# Altium project uz_per_wolfspeed_25kw_FM3.PrjPcb (part 1 of 2)
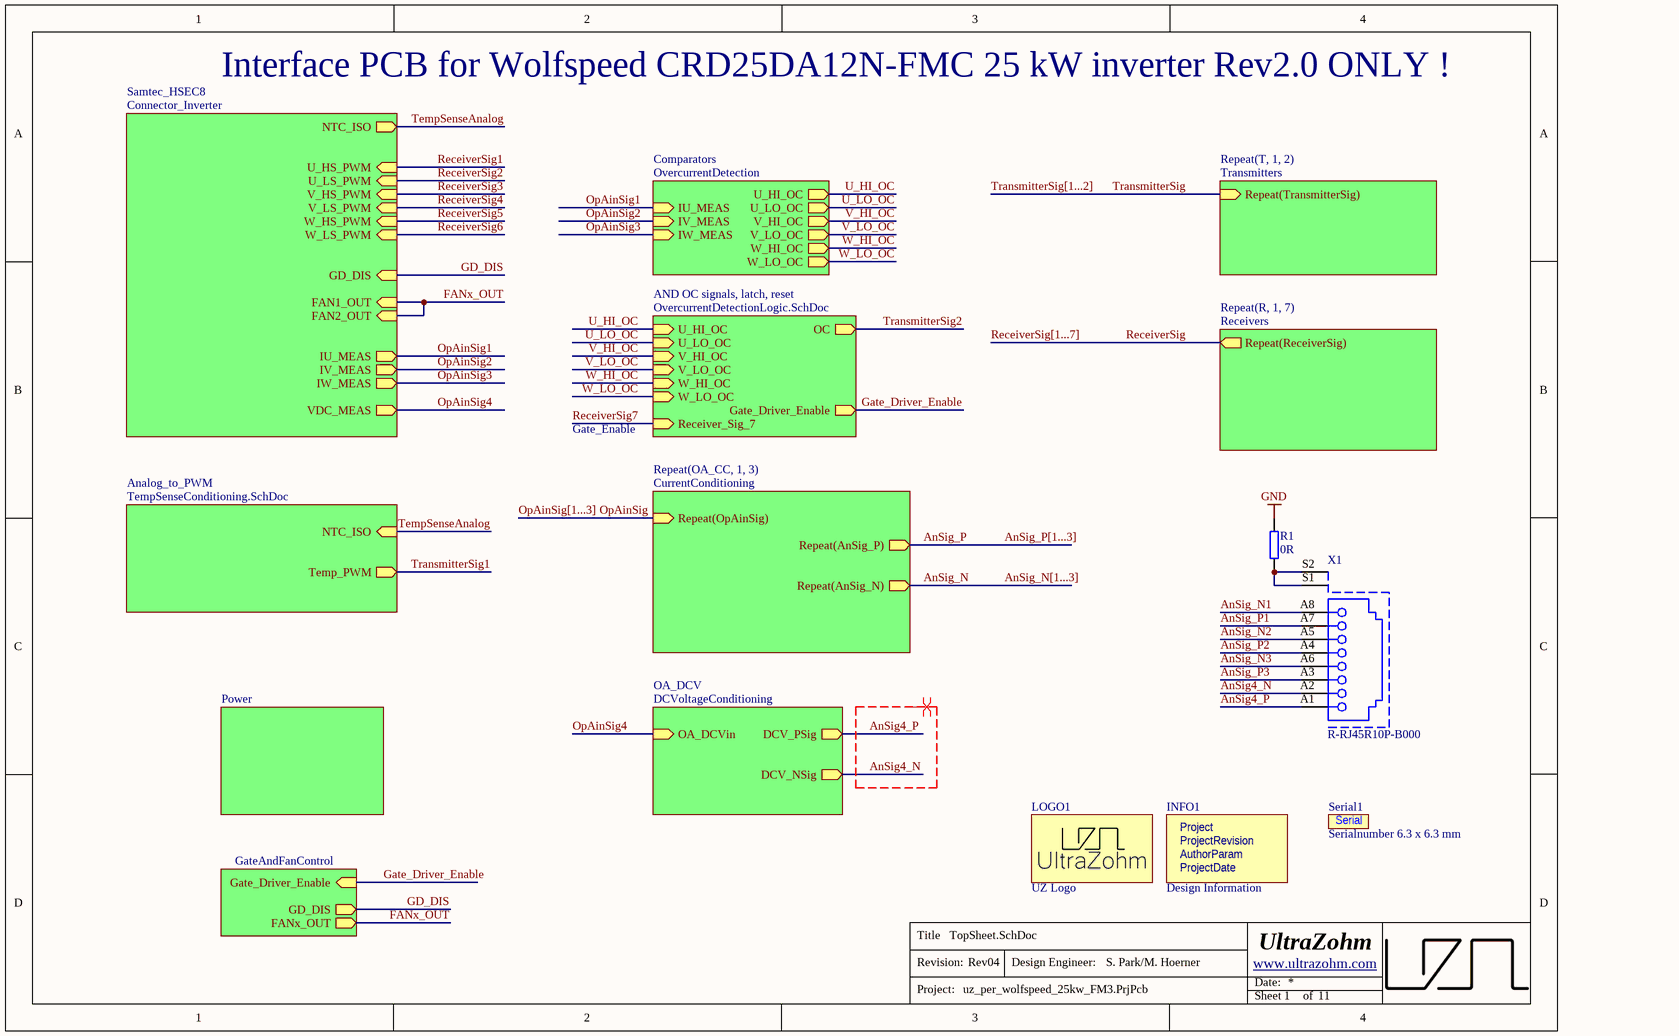
[diagram p0: TopSheet.SchDoc]
AuthorParam: S. Park/M. Hoerner; Project: uz_per_wolfspeed_25kw_FM3; ProjectDate: 06/26; ProjectRevision: Rev04
11 sheets, 229 parts. Net scope: hierarchical (ports join the sheet entries above them; power ports are global).
Board file: uz_per_wolfspeed_25kw_FM3.PcbDoc
Sheets:
  TopSheet.SchDoc
    Samtec_HSEC8 = Connector_Inverter.SchDoc
    OA_CC1 = CurrentConditioning.SchDoc
    OA_CC2 = CurrentConditioning.SchDoc
    OA_CC3 = CurrentConditioning.SchDoc
    T1 = Transmitters.SchDoc
    T2 = Transmitters.SchDoc
    Comparators = OvercurrentDetection.SchDoc
    R1 = Receivers.SchDoc
    R2 = Receivers.SchDoc
    R3 = Receivers.SchDoc
    R4 = Receivers.SchDoc
    R5 = Receivers.SchDoc
    R6 = Receivers.SchDoc
    R7 = Receivers.SchDoc
    Designator = Power.SchDoc
    OA_DCV = DCVoltageConditioning.SchDoc
    Gate_and_Fan_Control = GateAndFanControl.SchDoc
    AND OC signals, latch, reset = OvercurrentDetectionLogic.SchDoc
    Analog_to_PWM = TempSenseConditioning.SchDoc

## Sheet TopSheet.SchDoc
size A4; Organization: UltraZohm; DocumentNumber: 1; SheetNumber: 1; SheetTotal: 11; Website: www.ultrazohm.com

### Parts
INFO1  Design Information  [Design_info]  (no BOM)
LOGO1  UZ Logo  [UZ_Logo_small]  (no BOM)
R1  0R  [RES 0603_1608]
Serial1  Serialnumber 6.3 x 6.3 mm  [SERIAL_6.3X6.3MM]  (no BOM)
X1  R-RJ45R10P-B000  [R-RJ45R10P-B000]

### Sub-sheets
Analog_to_PWM = TempSenseConditioning.SchDoc: NTC_ISO (in), Temp_PWM (out)
AND OC signals, latch, reset = OvercurrentDetectionLogic.SchDoc: U_HI_OC (in), U_LO_OC (in), V_HI_OC (in), V_LO_OC (in), W_HI_OC (in), OC (out), W_LO_OC (in), Receiver_Sig_7 (in), Gate_Driver_Enable (out)
Comparators = OvercurrentDetection: IU_MEAS (in), IV_MEAS (in), IW_MEAS (in), U_HI_OC (out), U_LO_OC (out), V_HI_OC (out), V_LO_OC (out), W_HI_OC (out), W_LO_OC (out)
Designator = Power: no entries
Gate_and_Fan_Control = GateAndFanControl: FANx_OUT (out), GD_DIS (out), Gate_Driver_Enable (in)
OA_DCV = DCVoltageConditioning: OA_DCVin (in), DCV_PSig (out), DCV_NSig (out)
Repeat(OA_CC, 1, 3) = CurrentConditioning: Repeat(OpAinSig) (in), Repeat(AnSig_P) (out), Repeat(AnSig_N) (out)
Repeat(R, 1, 7) = Receivers: Repeat(ReceiverSig) (out)
Repeat(T, 1, 2) = Transmitters: Repeat(TransmitterSig) (in)
Samtec_HSEC8 = Connector_Inverter: NTC_ISO (out), U_HS_PWM (in), U_LS_PWM (in), V_HS_PWM (in), V_LS_PWM (in), W_HS_PWM (in), W_LS_PWM (in), GD_DIS (in), FAN1_OUT (in), FAN2_OUT (in), IU_MEAS (out), IV_MEAS (out), IW_MEAS (out), VDC_MEAS (out)

### Nets
GND: R1.1
AnSig4_N: X1.A2 ; sheet OA_DCV/DCV_NSig
AnSig4_P: X1.A1 ; sheet OA_DCV/DCV_PSig
AnSig_N: sheet Repeat(OA_CC, 1, 3)/Repeat(AnSig_N)
AnSig_N1: X1.A8  [project net AnSig_N]
AnSig_N2: X1.A5  [project net AnSig_N]
AnSig_N3: X1.A6  [project net AnSig_N]
AnSig_P: sheet Repeat(OA_CC, 1, 3)/Repeat(AnSig_P)
AnSig_P1: X1.A7  [project net AnSig_P]
AnSig_P2: X1.A4  [project net AnSig_P]
AnSig_P3: X1.A3  [project net AnSig_P]
FANx_OUT: sheet Samtec_HSEC8/FAN1_OUT, sheet Samtec_HSEC8/FAN2_OUT, sheet Gate_and_Fan_Control/FANx_OUT, sheet Gate_and_Fan_Control/Gate_Driver_Enable, sheet AND OC signals, latch, reset/Gate_Driver_Enable  [also labelled Gate_Driver_Enable]
GD_DIS: sheet Samtec_HSEC8/GD_DIS, sheet Gate_and_Fan_Control/GD_DIS
OpAinSig: sheet Repeat(OA_CC, 1, 3)/Repeat(OpAinSig)
OpAinSig1: sheet Samtec_HSEC8/IU_MEAS, sheet Comparators/IU_MEAS
OpAinSig2: sheet Samtec_HSEC8/IV_MEAS, sheet Comparators/IV_MEAS
OpAinSig3: sheet Samtec_HSEC8/IW_MEAS, sheet Comparators/IW_MEAS
OpAinSig4: sheet Samtec_HSEC8/VDC_MEAS, sheet OA_DCV/OA_DCVin
ReceiverSig: sheet Repeat(R, 1, 7)/Repeat(ReceiverSig)
TempSenseAnalog: sheet Samtec_HSEC8/NTC_ISO, sheet Analog_to_PWM/NTC_ISO
TransmitterSig: sheet Repeat(T, 1, 2)/Repeat(TransmitterSig)
U_HI_OC: sheet Comparators/U_HI_OC, sheet AND OC signals, latch, reset/U_HI_OC
U_LO_OC: sheet Comparators/U_LO_OC, sheet AND OC signals, latch, reset/U_LO_OC
V_HI_OC: sheet Comparators/V_HI_OC, sheet AND OC signals, latch, reset/V_HI_OC
V_LO_OC: sheet Comparators/V_LO_OC, sheet AND OC signals, latch, reset/V_LO_OC
W_HI_OC: sheet Comparators/W_HI_OC, sheet AND OC signals, latch, reset/W_HI_OC
W_LO_OC: sheet Comparators/W_LO_OC, sheet AND OC signals, latch, reset/W_LO_OC
NetR1_2: R1.2 X1.S1 X1.S2

### Buses and harness runs
bus AnSig_N[1...3]
bus AnSig_P[1...3]
bus OpAinSig[1...3]
bus ReceiverSig[1...7]
bus TransmitterSig[1...2]

### Layout directives
differential pair: AnSig4_N, AnSig4_P

### Notes on the sheet
- Interface PCB for Wolfspeed CRD25DA12N-FMC 25 kW inverter Rev2.0 ONLY !
- Gate_Enable
- Title
- Revision:
- Design Engineer:
- Date:
- Project:
- Sheet
- of
- (in symbol Design Information) Project; ProjectRevision; AuthorParam; ProjectDate
- (in symbol Serial Number) Serial

### Library data of the parts
INFO1 = Design Information: Manufacturer: UltraZohm; Created from: MGremer; Manufacturer Part Number: Design Information; PartID: 12; Created On: 03/11/2021 09:04:23; ComponentLink1Description: https://docs.ultrazohm.com/; ComponentLink1URL: homepage; Component Type: Design Information; Last Updated: 03/11/2021 09:28:34; Supplier 1: -; Supplier Part Number 1: -; Type: Design Information; Value: Design Information; Live Cycle Status: 1
LOGO1 = Logo small: Manufacturer: UltraZohm; Created from: MGremer; Created: Jan2021_Liegmann; Value: Logo; Manufacturer Part Number: Logo small; PartID: 10; Created On: 03.11.2021 09:04:23; ComponentLink1Description: https://docs.ultrazohm.com/; ComponentLink1URL: homepage; Component Type: Logo; Last Updated: 03.11.2021 09:05:50; Supplier 1: -; Supplier Part Number 1: -; Type: Logo; Live Cycle Status: 1
R1 = RC0603JR-070RL: SMD resistor E24 series; Manufacturer: YAGEO; Tolerance: 5%; Created from: MGremer; Manufacturer Part Number: RC0603JR-070RL; PartID: 1; Created On: 14/12/2020 16:17:14; ComponentLink1Description: Datasheet; ComponentLink1URL: https://www.mouser.de/datasheet/2/447/PYu-RC_Group_51_RoHS_L_10-1664068.pdf; Component Type: SMD resistor; Device Package: 0603; Last Updated: 04/03/2021 09:09:42; Mounting Type: SMD; Supplier 1: Mouser; Supplier Part Number 1: 603-RC0603JR-070RL; Supplier 2: LCSC; Supplier Part Number 2: C21189; Type: Resistor; Value: 0R; Live Cycle Status: 1; Stock number: Labor SMD Container; LCSC Part Number: C21189
Serial1 = Serial Number: Manufacturer: UltraZohm; Value: REV; Created from: MGremer; Created: 2018_09_18_AGeiger; Manufacturer Part Number: Serial Number; PartID: 11; Created On: 03.11.2021 09:04:23; ComponentLink1Description: https://docs.ultrazohm.com/; ComponentLink1URL: homepage; Component Type: Serial Number; Last Updated: 03.11.2021 09:28:34; Supplier 1: -; Supplier Part Number 1: -; Type: Serial Number; Live Cycle Status: 1
X1 = R-RJ45R10P-B000: LCSC Part Number: C386758

## Sheet Connector_Inverter.SchDoc
size A4; Organization: UltraZohm; DocumentNumber: 2; SheetNumber: 2; SheetTotal: 11; Website: www.ultrazohm.com
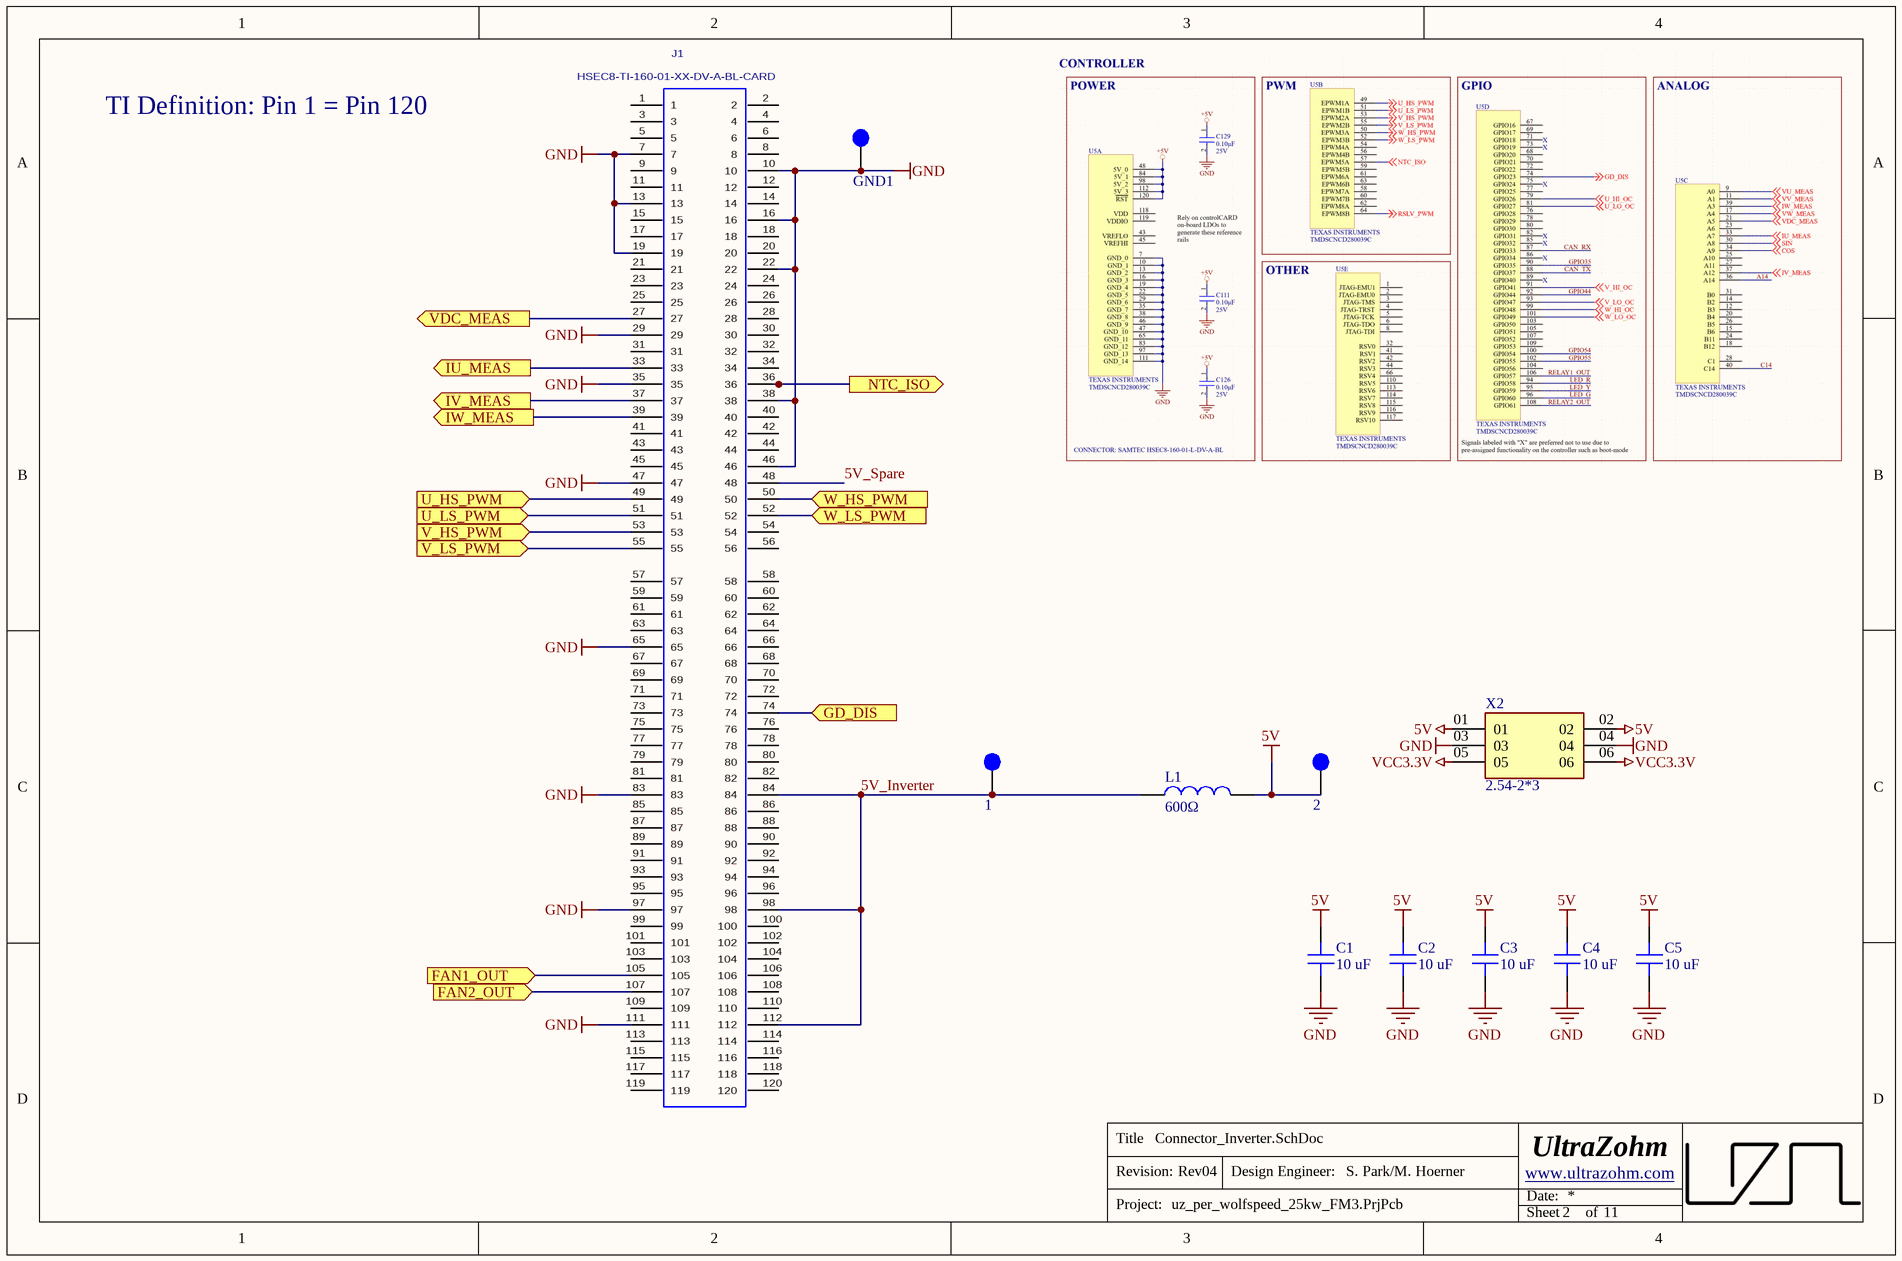
[diagram p1: Connector_Inverter.SchDoc]

### Parts
1  Testpoint 1mm  [TP_1mm]  (value not drawn)  (no BOM)
2  Testpoint 1mm  [TP_1mm]  (value not drawn)  (no BOM)
C1  10 uF  [C_1206]
C2  10 uF  [C_1206]
C3  10 uF  [C_1206]
C4  10 uF  [C_1206]
C5  10 uF  [C_1206]
GND1  Testpoint 1mm  [TP_1mm]  (value not drawn)  (no BOM)
J1  HSEC8-TI-160-01-XX-DV-A-BL-CARD  [HSEC8-TI-160-SAMTEC-Connector]
L1  600Ω  [WE-CBF_0805_High Current]
X2  2.54-2*3  [SAMTEC_TSW-103-05-G-D]

### Ports
FAN1_OUT (in, see TopSheet[2B]), FAN2_OUT (in, see TopSheet[2B]), GD_DIS (in, see TopSheet[2B], GateAndFanControl[1B]), IU_MEAS (out, see TopSheet[2B], OvercurrentDetection[1A]), IV_MEAS (out, see TopSheet[2B], OvercurrentDetection[1A]), IW_MEAS (out, see TopSheet[2B], OvercurrentDetection[1A]), NTC_ISO (out, see TopSheet[2A], TempSenseConditioning[1A]), U_HS_PWM (in, see TopSheet[2A]), U_LS_PWM (in, see TopSheet[2A]), V_HS_PWM (in, see TopSheet[2A]), V_LS_PWM (in, see TopSheet[2A]), VDC_MEAS (out, see TopSheet[2B]), W_HS_PWM (in, see TopSheet[2A]), W_LS_PWM (in, see TopSheet[2A])

### Nets
5V: 2.1 C1.1 C2.1 C3.1 C4.1 C5.1 L1.2 X2.01 X2.02
GND: C1.2 C2.2 C3.2 C4.2 C5.2 GND1.1 J1.7 J1.10 J1.13 J1.16 J1.19 J1.22 J1.29 J1.35 J1.38 J1.46 J1.47 J1.65 J1.83 J1.97 J1.111 X2.03 X2.04
VCC3.3V: X2.05 X2.06
5V_Inverter: 1.1 J1.84 J1.98 J1.112 L1.1
5V_Spare: J1.48
FANx_OUT: J1.105 J1.107 ; port FAN2_OUT, port FAN1_OUT
GD_DIS: J1.74 ; port GD_DIS
OpAinSig1: J1.33 ; port IU_MEAS
OpAinSig2: J1.37 ; port IV_MEAS
OpAinSig3: J1.39 ; port IW_MEAS
OpAinSig4: J1.27 ; port VDC_MEAS
ReceiverSig1: J1.49 ; port U_HS_PWM
ReceiverSig2: J1.51 ; port U_LS_PWM
ReceiverSig3: J1.53 ; port V_HS_PWM
ReceiverSig4: J1.55 ; port V_LS_PWM
ReceiverSig5: J1.50 ; port W_HS_PWM
ReceiverSig6: J1.52 ; port W_LS_PWM
TempSenseAnalog: J1.36 ; port NTC_ISO

Not connected (* = marked no-connect by the designer): J1 1 2 3 4 5 6 8 9 11 12 14 15 17 18 20 21 23 24 25 26 28 30 31 32 34 40 41 42 43 44 45 54 56 57 58 59 60 61 62 63 64 66 67 68 69 70 71 72 73 75 76 77 78 79 80 81 82 85 86 87 88 89 90 91 92 93 94 95 96 99 100 101 102 103 104 106 108 109 110 113 114 115 116 117 118 119 120

### Notes on the sheet
- TI Definition: Pin 1 = Pin 120
- Title
- Revision:
- Design Engineer:
- Date:
- Project:
- Sheet
- of

### Library data of the parts
1 2 GND1 = TP_1mm: Created: 2018_06_25_AGeiger; Value: Testpoint 1mm
C1-C5 = CL31A106KBHNNNE: 50V 10uF X5R ±10% 1206 Multilayer Ceramic Capacitors MLCC - SMD/SMT ROHS; Manufacturer: Samsung Electro-Mechanics; Created from: SPark; Manufacturer Part Number: CL31A106KBHNNNE; PartID: 164; Created On: 28/02/2025 14:49:17; ComponentLink1Description: Datasheet; ComponentLink1URL: https://www.lcsc.com/datasheet/lcsc_datasheet_2304140030_Samsung-Electro-Mechanics-CL31A106KBHNNNE_C13585.pdf; Component Type: Capacitor 1206; Device Package: 1206; Last Updated: 28/02/2025 14:49:17; Mounting Type: SMD; Operating Temperature: -55 to + 85°C; Series: X5R; Supplier 1: LCSC; Supplier Part Number 1: C13585; Type: Capacitor; Tolerance: 10%; Voltage Rating: 50V; Value: 10 uF; Live Cycle Status: 1; LCSC Part Number: C13585
J1 = HSEC8-TI-160-01-XX-DV-A-BL-CARD: MATING CARD LAYOUT FOR HSEC8-160-01-XX-DV-A-BL.; MANUFACTURER: SAMTEC; PCB DECAL: HSEC8-160-01-XX-DV-A-BL-CARD; CREATED: April 20, 2018 - Wendy Xin; Design Item ID: HSEC8-160-01-XX-DV-A-BL-CARD; Source: HSEC8-160-01-XX-DV-A-BL-CARD.SCHLIB; Component Type: Standard; Pin Count: 120
L1 = WE-CBF, 742792040: WE-CBF SMD EMI Suppression Ferrite Bead, 0805, 600Ω; MF: Wurth Elektronik; Type: High Current; PublishedDate: Aug 2016; ComponentLink1Description: Manufacturer; ComponentLink1URL: http://www.we-online.de; ComponentLink2Description: Datasheet; ComponentLink2URL: http://katalog.we-online.de/pbs/datasheet/742792040.pdf; MPN: 742792040; Value: 600Ω; Package: 0805; Supplier 1: Farnell; Supplier 2: Mouser; Supplier 3: Digi-Key; Supplier Part Number 1: 2761567; Supplier Part Number 2: 710-742792040; Supplier Part Number 3: 732-1620-1-ND; LCSC Part Number: C98308
X2 = 2.54-2*3: Pin Header 3x2; Manufacturer: ZHOURI; MF: Samtec; Created from: KIlhan; Number of positions: 3; Availability: Unavailable; Value: *; Price: None; MP: TSW-103-05-G-D; Package: None; Manufacturer Part Number: 2.54-2*3; PartID: 14; Created On: 05.07.2023 16:24:09; ComponentLink1Description: Datasheet; ComponentLink1URL: https://datasheet.lcsc.com/lcsc/2207291800_ZHOURI-2-54-1-3_C5116482.pdf; Component Type: Pin Header; Device Package: THT; Last Updated: 11.02.2025 12:55:43; Mounting Type: THT; Operating Temperature: -55 -125 °C; Series: 2.54-1*3; Supplier 1: LCSC; Supplier Part Number 1: ZHOURI 2.54-1*3; Type: Pin Header; Live Cycle Status: 1; LCSC Part Number: C5116479; Stock number: not stored; Number of rows: 2

## Sheet CurrentConditioning.SchDoc
size A4; Organization: UltraZohm; DocumentNumber: 3; SheetNumber: 3; SheetTotal: 11; SPICEModelCacheMURSBSRZ: <root> / <DocumentId>MURSBSRZ</DocumentId> / </root>; Website: www.ultrazohm.com
Used 3 times, as channels OA_CC1, OA_CC2, OA_CC3. Parts and nets are listed once, with the designators drawn on the sheet.
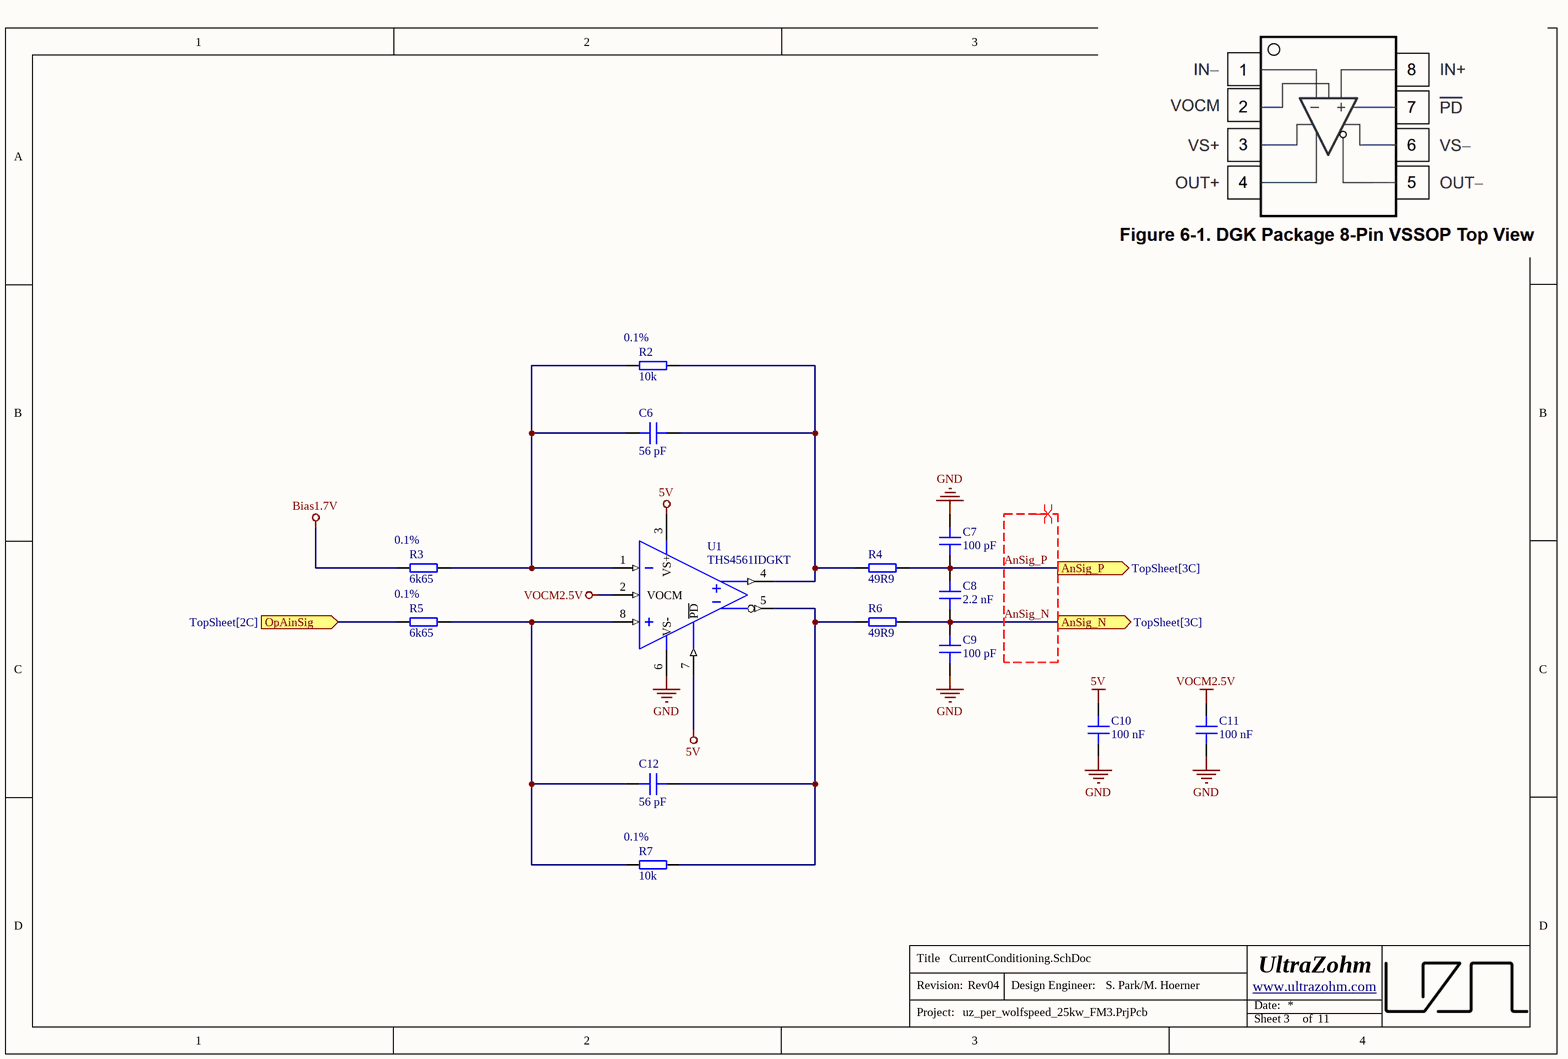
[diagram p2: CurrentConditioning.SchDoc]

### Parts
C6  56 pF  [C_0603]
C7  100 pF  [C_0603_TE]
C8  2.2 nF  [C_0603]
C9  100 pF  [C_0603_TE]
C10  100 nF  [C_0603]
C11  100 nF  [C_0603]
C12  56 pF  [C_0603]
R2  10k  Tolerance: 0.1%  [RES 0603_1608]
R3  6k65  Tolerance: 0.1%  [RES 0603_1608]
R4  49R9  [RES 0603_1608]
R5  6k65  Tolerance: 0.1%  [RES 0603_1608]
R6  49R9  [RES 0603_1608]
R7  10k  Tolerance: 0.1%  [RES 0603_1608]
U1  THS4561IDGKT  [SOP65P490X110-8N]

### Ports
AnSig_N (out, see TopSheet[3C]), AnSig_P (out, see TopSheet[3C]), OpAinSig (in, see TopSheet[2C])

### Nets
5V: C10.1 U1.3(VS+) U1.7(~{PD})
Bias1.7V: R3.1
GND: C7.1 C9.2 C10.2 C11.2 U1.6(VS-)
VOCM2.5V: C11.1 U1.2(VOCM)
AnSig_N: C8.2 C9.1 R6.2 ; port AnSig_N
AnSig_P: C7.2 C8.1 R4.2 ; port AnSig_P
OpAinSig: R5.1 ; port OpAinSig
NetC6_1: C6.1 R2.1 R3.2 U1.1(VIN-)
NetC6_2: C6.2 R2.2 R4.1 U1.4(VOUT+)
NetC12_1: C12.1 R5.2 R7.1 U1.8(VIN+)
NetC12_2: C12.2 R6.1 R7.2 U1.5(VOUT-)

### Channels
OA_CC1: designators end in A; ports AnSig_N=AnSig_N AnSig_P=AnSig_P OpAinSig=OpAinSig1
OA_CC2: designators end in B; ports AnSig_N=AnSig_N AnSig_P=AnSig_P OpAinSig=OpAinSig2
OA_CC3: designators end in C; ports AnSig_N=AnSig_N AnSig_P=AnSig_P OpAinSig=OpAinSig3

### Layout directives
differential pair: AnSig_N, AnSig_P

### Notes on the sheet
- Title
- Revision:
- Design Engineer:
- Date:
- Project:
- Sheet
- of

### Library data of the parts
C6 C12 = CL10C560JB8NNNC: Capacitor 0603, 50 VDC, 56 pF, C0G; Manufacturer: Samsung Electro-Mechanics; Tolerance: 5 %; Voltage Rating: 50 VDC; Created from: DHufnagel; Manufacturer Part Number: CL10C560JB8NNNC; PartID: 92; Created On: 20.12.2020 13:54:13; ComponentLink1Description: Datasheet; ComponentLink1URL: https://www.mouser.de/datasheet/2/585/MLCC-1837944.pdf; Component Type: Capacitor 0603; Device Package: 0603; Last Updated: 20.12.2020 16:24:16; Mounting Type: SMD; Operating Temperature: -55 - 125°C; Series: CL; Supplier 1: Mouser; Supplier Part Number 1: 187-CL10C560JB8NNNC; Supplier 2: LCSC; Supplier Part Number 2: C39148; Type: Capacitor; Value: 56 pF; Live Cycle Status: 1; LCSC Part Number: C39148; Stock number: not stored
C7 C9 = CL10C101JB8NNNC: 50V 100pF C0G ±5% 0603 Multilayer Ceramic Capacitors MLCC - SMD/SMT ROHS; Manufacturer: Samsung Electro-Mechanics; Voltage Rating: 50 VDC; Created from: AGeiger; Manufacturer Part Number: CL10C101JB8NNNC; PartID: 106; Created On: 03/09/2022 10:55:28; ComponentLink1Description: Datasheet; ComponentLink1URL: https://datasheet.lcsc.com/lcsc/1811151136_Samsung-Electro-Mechanics-CL10C101JB8NNNC_C14858.pdf; Component Type: Capacitor 0603; Device Package: 0603; Last Updated: 08/08/2024 13:37:35; Mounting Type: SMD; Operating Temperature: -55 - 125°C; Series: C0G; Supplier 1: LCSC; Supplier Part Number 1: C14858; Supplier 2: Mouser; Supplier Part Number 2: 187-CL10C101JB8NNNC; Type: Capacitor; Tolerance: 5 %; Value: 100 pF; Live Cycle Status: 1; LCSC Part Number: C14858
C8 = 06035C222JAT2A: Capacitor 0603, 50 VDC, 2.2 nF, X7R; Manufacturer: AVX; Tolerance: 5 %; Voltage Rating: 50 VDC; Created from: MGremer; Manufacturer Part Number: 06035C222JAT2A; PartID: 77; Created On: 20/12/2020 13:54:13; ComponentLink1Description: Datasheet; ComponentLink1URL: https://www.mouser.de/datasheet/2/40/X7RDielectric-777024.pdf; Component Type: Capacitor 0603; Device Package: 0603; Last Updated: 15/02/2023 17:14:22; Mounting Type: SMD; Operating Temperature: -55 - 125°C; Series: MLCC X7R; Supplier 1: LCSC; Supplier Part Number 1: C86023; Supplier 2: LCSC; Supplier Part Number 2: C86023; Type: Capacitor; Value: 2.2 nF; Live Cycle Status: 1; Stock number: not stored; LCSC Part Number: C93190
C10 C11 = C0603C104K5RAC3121: Capacitor 0603, 50 VDC, 100nF, X7R; Manufacturer: KEMET; Tolerance: 10 %; Voltage Rating: 50 VDC; Created from: DHufnagel; Manufacturer Part Number: C0603C104K5RAC3121; PartID: 99; Created On: 11/08/2022 14:33:29; ComponentLink1Description: Datasheet; ComponentLink1URL: https://www.mouser.de/datasheet/2/212/KEM_C1023_X7R_AUTO_SMD-1093309.pdf; Component Type: Capacitor 0603; Device Package: 0603; Last Updated: 19/08/2022 08:26:58; Mounting Type: SMD; Operating Temperature: -55 - 125°C; Series: X7R; Supplier 1: Mouser; Supplier Part Number 1: 80-C603C104K5RAC3121; Supplier 2: LCSC; Supplier Part Number 2: C14663; Type: Capacitor; Value: 100 nF; Live Cycle Status: 1; LCSC Part Number: C14663; Stock number: not stored
R2 R7 = ERA-3ARB103V: SMD resistor 0.1%, 10ppm; Manufacturer: Panasonic; Created from: DHufnagel; Manufacturer Part Number: ERA-3ARB103V; PartID: 217; Created On: 14/12/2020 16:17:14; ComponentLink1Description: Datasheet; ComponentLink1URL: https://www.mouser.de/datasheet/2/315/AOA0000C307-1149632.pdf; Component Type: SMD resistor; Device Package: 0603; Last Updated: 25/07/2022 10:07:28; Mounting Type: SMD; Supplier 1: Mouser; Supplier Part Number 1: 667-ERA-3ARB103V; Type: Resistor; Value: 10k; Live Cycle Status: 1; Stock number: not stored; LCSC Part Number: C860067
R3 R5 = RT0603BRD076K65L: 100mW Thin Film Resistor ±25ppm/℃ ±0.1% 6.65kΩ 0603 Chip Resistor - Surface Mount ROHS; Manufacturer: YAGEO; Created from: SPark; Manufacturer Part Number: RT0603BRD076K65L; PartID: 361; Created On: 30/01/2025 15:18:29; ComponentLink1Description: Datasheet; ComponentLink1URL: https://wmsc.lcsc.com/wmsc/upload/file/pdf/v2/lcsc/2210190000_YAGEO-RT0603BRD076K65L_C861536.pdf; Component Type: SMD resistor; Device Package: 0603; Last Updated: 30/01/2025 15:27:22; Mounting Type: SMD; Supplier 1: LCSC/JLCPCB; Supplier Part Number 1: C861536; Type: Resistor; Value: 6k65; Live Cycle Status: 1; LCSC Part Number: C861536
R4 R6 = RK73H1JTTD49R9F: SMD resistor 1%; Manufacturer: KOA Speer; Created from: DHufnagel; Manufacturer Part Number: RK73H1JTTD49R9F; PartID: 214; Created On: 14.12.2020 16:17:14; ComponentLink1Description: Datasheet; ComponentLink1URL: https://www.mouser.de/datasheet/2/219/RK73H-1825326.pdf; Component Type: SMD resistor; Device Package: 0603; Last Updated: 27.05.2022 13:46:35; Mounting Type: SMD; Supplier 1: Mouser; Supplier Part Number 1: 660-RK73H1JTTD49R9F; Supplier 2: LCSC; Supplier Part Number 2: C160046; Type: Resistor; Tolerance: 1%; Value: 49R9; Live Cycle Status: 1; Stock number: not stored; LCSC Part Number: C160046
U1 = THS4561IDGKT: Fully Differential Amplifier, Low-Power, High Supply Range, 60-MHz; Manufacturer: Texas Instruments; Channels: 1; GBP: 68 MHz; CMRR: 110 dB; Value: Rail-to-Rail; Created from: DHufnagel; Manufacturer Part Number: THS4561IDGKT; PartID: 13; Created On: 08/07/2022 14:29:07; ComponentLink1Description: Datasheet; ComponentLink1URL: https://www.ti.com/general/docs/suppproductinfo.tsp?distId=26&gotoUrl=https://www.ti.com/lit/gpn/ths4561; Component Type: Differential Amplifier; Device Package: VSSOP-8; Last Updated: 30/09/2024 15:54:43; Mounting Type: SMD; Operating Temperature: -40 to +125 °C; Series: THS4561; Supplier 1: Mouser; Supplier Part Number 1: 595-THS4561IDGKT; Supplier 2: Digi-Key; Supplier Part Number 2: 296-THS4561IDGKTCT-ND; Type: Differential Amplifiers; Live Cycle Status: 1; Stock number: not stored; LCSC Part Number: C2860980

## Sheet Transmitters.SchDoc
size A4; Organization: UltraZohm; DocumentNumber: 6; SheetNumber: 6; SheetTotal: 11; Website: www.ultrazohm.com
Used 2 times, as channels T1, T2. Parts and nets are listed once, with the designators drawn on the sheet.
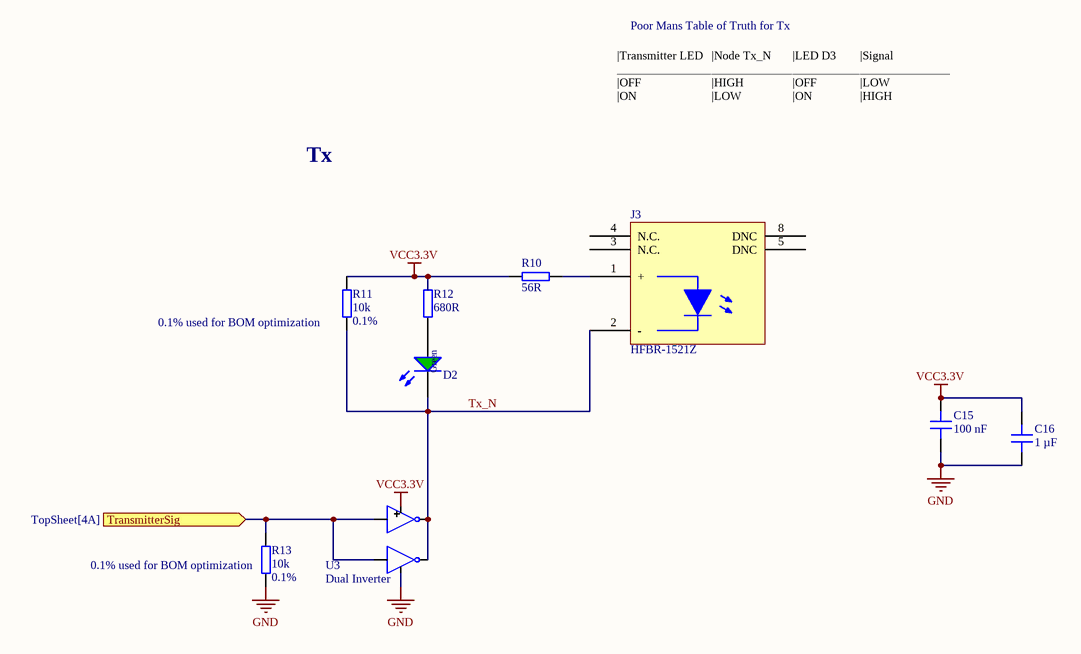
[diagram p3: Transmitters.SchDoc]

### Parts
C15  100 nF  [C_0603]
C16  1 µF  [C_0603]
D2  150060GS75000  [WL-SMCW_0603]  (value not drawn)
J3  HFBR-1521Z  [HFBRx5XX]
R10  56R  [RES_2012X06N]
R11  10k  Tolerance: 0.1%  [RES 0603_1608]
R12  680R  [R_0603_N]
R13  10k  Tolerance: 0.1%  [RES 0603_1608]
U3  Dual Inverter  [SN74LVC2GU04DCKR]

### Ports
TransmitterSig (in, see TopSheet[4A])

### Nets
GND: C15.2 C16.2 R13.2 U3.2(GND)
VCC3.3V: C15.1 C16.1 R10.1 R11.1 R12.1 U3.5(VCC)
TransmitterSig: R13.1 U3.1(IN1) U3.3(IN2) ; port TransmitterSig
Tx_N: D2.1(K) J3.2(-) R11.2 U3.4(OUT2) U3.6(OUT2)
NetD2_2: D2.2(A) R12.2
NetJ3_1: J3.1(+) R10.2

Not connected (* = marked no-connect by the designer): J3 3(N.C.) 4(N.C.) 5(DNC) 8(DNC)

### Channels
T1: designators end in A; ports TransmitterSig=TransmitterSig1
T2: designators end in B; ports TransmitterSig=OC_latched

### Notes on the sheet
- Poor Mans Table of Truth for Tx
- |Transmitter LED
  _________________
  |OFF
  |ON
- |Node Tx_N
  _________________
  |HIGH
  |LOW
- |LED D3
  _______________
  |OFF
  |ON
- GATE
  _______
  LOW
  HIGH
- |Signal
  _______________
  |LOW
  |HIGH
- Tx
- (near R11) 0.1% used for BOM optimization
- (near R13) 0.1% used for BOM optimization
- Title
- Revision:
- Design Engineer:
- Date:
- Project:
- Sheet
- of

### Library data of the parts
C15 = C0603C104K5RAC3121: as C10 on sheet CurrentConditioning; Manufacturer Part Number: C0603C104K5RAC3121; PartID: 99; Created On: 11/08/2022 14:33:29; ComponentLink1Description: Datasheet; ComponentLink1URL: https://www.mouser.de/datasheet/2/212/KEM_C1023_X7R_AUTO_SMD-1093309.pdf; Component Type: Capacitor 0603; Device Package: 0603; Last Updated: 19/08/2022 08:26:58; Mounting Type: SMD; Operating Temperature: -55 - 125°C; Series: X7R; Supplier 1: Mouser; Supplier Part Number 1: 80-C603C104K5RAC3121; Supplier 2: LCSC; Supplier Part Number 2: C14663; Type: Capacitor; Value: 100 nF; Live Cycle Status: 1; LCSC Part Number: C14663; Stock number: not stored
C16 = C0603C105K3RAC7411: Capacitor 0603, 25 VDC, 1 µF, X7R; Manufacturer: KEMET; Tolerance: 10 %; Voltage Rating: 25 VDC; Created from: MGremer; Manufacturer Part Number: C0603C105K3RAC7411; PartID: 4; Created On: 20/12/2020 13:54:13; ComponentLink1Description: Datasheet; ComponentLink1URL: https://www.mouser.de/datasheet/2/212/KEM_C1002_X7R_SMD-1102033.pdf; Component Type: Capacitor 0603; Device Package: 0603; Last Updated: 20/12/2020 16:43:05; Mounting Type: SMD; Operating Temperature: -55 - 125°C; Series: SMD Comm X7R; Supplier 1: Mouser; Supplier Part Number 1: 80-C0603C105K3RLR; Type: Capacitor; Value: 1 µF; Live Cycle Status: 1; Stock number: Labor SMD Container; LCSC Part Number: C29936
D2 = LED_Green_0603: WL-SMCW SMD Mono-color Chip LED Waterclear, size 0603, Green, 3.2 V, 140°; Forward Voltage: 3.2 V; Luminous Intensity: 430 mcd; Peak Wavelength: 515 nm; Dominant Wavelength: 520 nm; MF: Wuerth Elektronik; Published Date: Sep. 2017; ComponentLink1Description: Manufacturer; ComponentLink1URL: http://www.we-online.de; ComponentLink2Description: Datasheet; ComponentLink2URL: http://katalog.we-online.com/led/datasheet/150060GS75000.pdf; MPN: 150060GS75000; Size: 0603; Viewing Angle: 140°; Emitting Color: Green; Value: 150060GS75000; Package: 0603; Created: 2018_09_06_AGeiger; Supplier 1: Farnell; Supplier Part Number 1: 2322070; Supplier 2: Mouser; Supplier Part Number 2: 710-150060GS75000; Supplier 3: Digi-Key; Supplier Part Number 3: 732-4971-1-ND; LCSC Part Number: C965804
J3 = HFBR-1521Z: Fibre Optic Transmitters, Link Horiz 5MBd Tx RoHS; Manufacturer: Broadcom; MF: Broadcom/Avago; Wavelength: 660 nm; Foreward Current: 60 mA; Supply Voltage: 5V; Created from: VStarost; Created: 2019_04_09_Kreppel; MPN: HFBR-1521Z; Data Rate: 5 MBd; Supplier 1: Mouser; Supplier 2: Digi-Key; Supplier Part Number 1: 630-HFBR-1521Z; Supplier Part Number 2: 516-2043-ND; Manufacturer Part Number: HFBR-1521Z; PartID: 2; Created On: 27.12.2022 10:35:16; ComponentLink1Description: Datasheet; ComponentLink1URL: https://datasheet.ciiva.com/19453/1584669-19453911.pdf?src-supplier=Jameco; Component Type: LWL Transmitter; Device Package: THT; Last Updated: 27.12.2022 10:35:16; Mounting Type: THT; Series: HFBR; Type: LWL Transmitter; Live Cycle Status: 1; Stock number: not stored
R10 = R_0805: SMD Resistor 0805; MPN: CR0805-FX-1200ELF; Case_EIA: 0805; MF: Bourns; Voltage: 150 V; Power: 125 mW; Tolerance: 1%; Value: 56R; Supplier 1: Mouser; Supplier Part Number 1: 652-CR0805FX-1200ELF*; LCSC Part Number: C17437
R11 R13 = ERA-3ARB103V: as R2 on sheet CurrentConditioning; Manufacturer Part Number: ERA-3ARB103V; PartID: 217; Created On: 14/12/2020 16:17:14; ComponentLink1Description: Datasheet; ComponentLink1URL: https://www.mouser.de/datasheet/2/315/AOA0000C307-1149632.pdf; Component Type: SMD resistor; Device Package: 0603; Last Updated: 25/07/2022 10:07:28; Mounting Type: SMD; Supplier 1: Mouser; Supplier Part Number 1: 667-ERA-3ARB103V; Type: Resistor; Value: 10k; Live Cycle Status: 1; Stock number: not stored; LCSC Part Number: C860067
R12 = R_0603: SMD Resistor 0603; MPN: CR0603-FX-3901ELF; Tolerance: 1%; Voltage: 75V; Power: 100 mW; MF: Bourns; Package: 0603; Value: 680R; Created: 2018_09_06_AGeiger; Supplier 1: Mouser; Supplier Part Number 1: 652-CR0603-FX3901ELF; LCSC Part Number: C23228
U3 = SN74LVC2GU04DCKR: This dual inverter is designed for 1.65-V to 5.5-V VCC / operation.; JLCSMT Rotation: 180; LCSC Part Number: C116660

## Sheet OvercurrentDetection.SchDoc
size A4; Organization: UltraZohm; DocumentNumber: 7; SheetNumber: 7; SheetTotal: 11; Website: www.ultrazohm.com
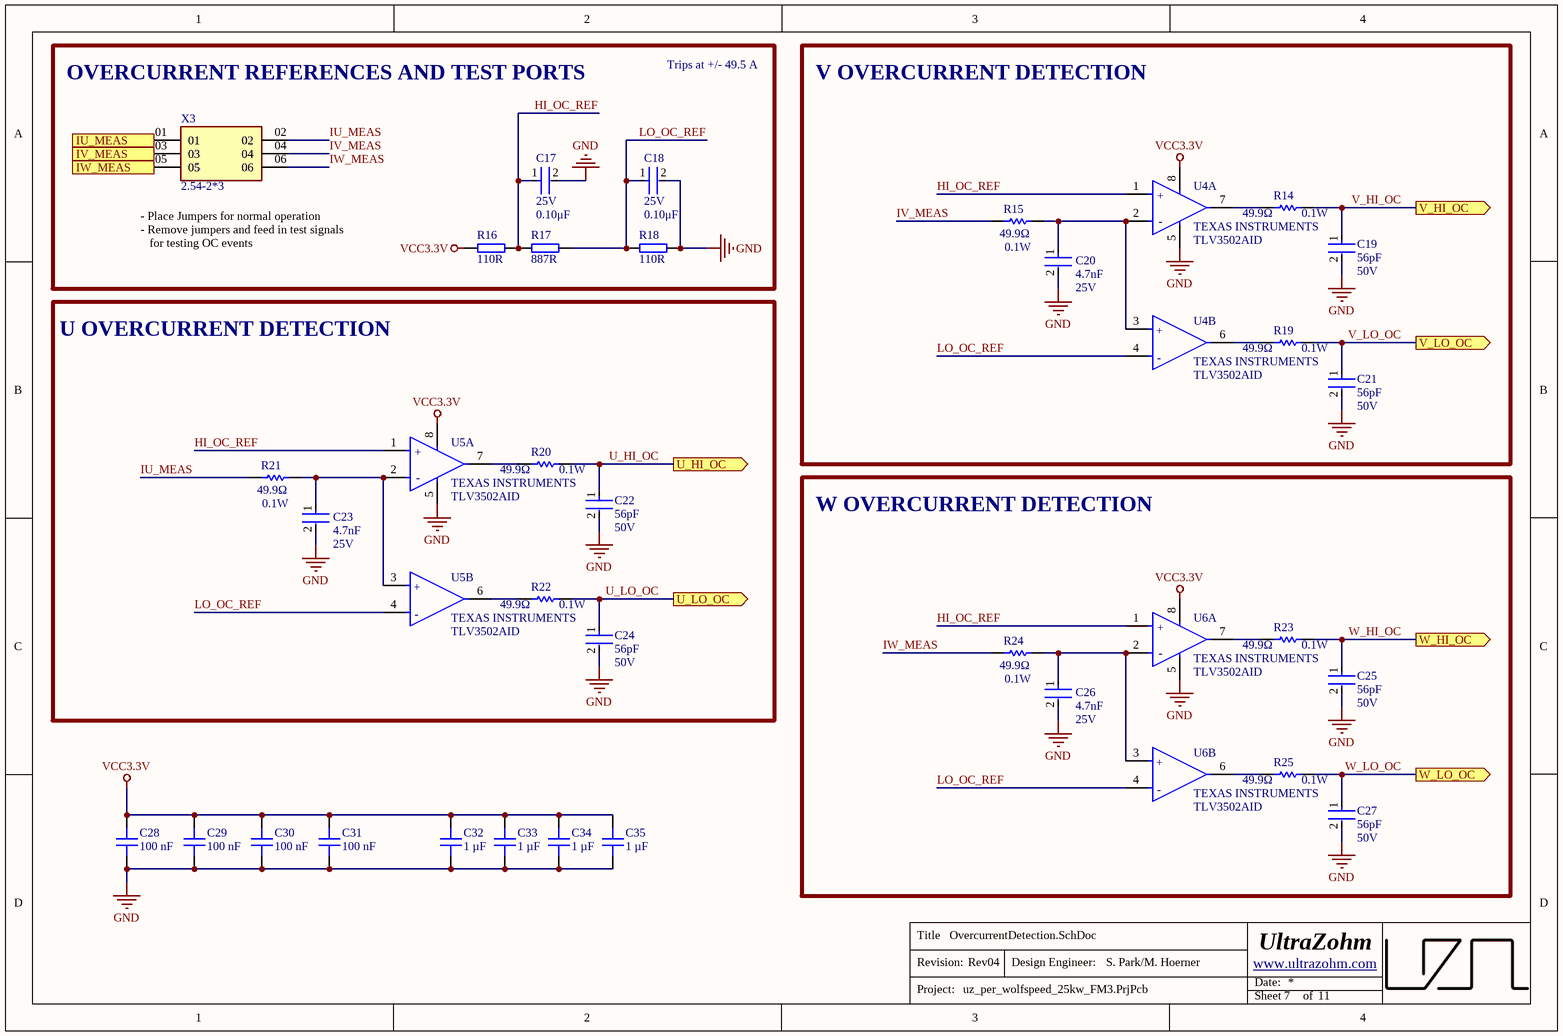
[diagram p4: OvercurrentDetection.SchDoc]

### Parts
C17  Voltage Rating: 25V  Capacitance: 0.10μF  [FP-C0603C-CF-IPC_B]  (hidden comment: C0603C104K3RACTU)
C18  Voltage Rating: 25V  Capacitance: 0.10μF  [FP-C0603C-CF-IPC_B]  (hidden comment: C0603C104K3RACTU)
C19  Capacitance: 56pF  Voltage Rating: 50V  [FP-C0603C-CF-IPC_B]  (hidden comment: CL10C560JB8NNNC)
C20  Voltage Rating: 25V  Capacitance: 4.7nF  [FP-C0603C-CF-IPC_B]  (hidden comment: C0603C472K3RAC7867)
C21  Capacitance: 56pF  Voltage Rating: 50V  [FP-C0603C-CF-IPC_B]  (hidden comment: CL10C560JB8NNNC)
C22  Capacitance: 56pF  Voltage Rating: 50V  [FP-C0603C-CF-IPC_B]  (hidden comment: CL10C560JB8NNNC)
C23  Voltage Rating: 25V  Capacitance: 4.7nF  [FP-C0603C-CF-IPC_B]  (hidden comment: C0603C472K3RAC7867)
C24  Capacitance: 56pF  Voltage Rating: 50V  [FP-C0603C-CF-IPC_B]  (hidden comment: CL10C560JB8NNNC)
C25  Capacitance: 56pF  Voltage Rating: 50V  [FP-C0603C-CF-IPC_B]  (hidden comment: CL10C560JB8NNNC)
C26  Voltage Rating: 25V  Capacitance: 4.7nF  [FP-C0603C-CF-IPC_B]  (hidden comment: C0603C472K3RAC7867)
C27  Capacitance: 56pF  Voltage Rating: 50V  [FP-C0603C-CF-IPC_B]  (hidden comment: CL10C560JB8NNNC)
C28  100 nF  [C_0603]
C29  100 nF  [C_0603]
C30  100 nF  [C_0603]
C31  100 nF  [C_0603]
C32  1 µF  [C_0603]
C33  1 µF  [C_0603]
C34  1 µF  [C_0603]
C35  1 µF  [C_0603]
R14  Resistance: 49.9Ω  Power Rating: 0.1W  [FP-MCR03-IPC_B]  (hidden comment: ERJ-3EKF49R9V)
R15  Resistance: 49.9Ω  Power Rating: 0.1W  [FP-MCR03-IPC_B]  (hidden comment: ERJ-3EKF49R9V)
R16  110R  [R_0603_TE]
R17  887R  [R_0603_TE]
R18  110R  [R_0603_TE]
R19  Resistance: 49.9Ω  Power Rating: 0.1W  [FP-MCR03-IPC_B]  (hidden comment: ERJ-3EKF49R9V)
R20  Resistance: 49.9Ω  Power Rating: 0.1W  [FP-MCR03-IPC_B]  (hidden comment: ERJ-3EKF49R9V)
R21  Resistance: 49.9Ω  Power Rating: 0.1W  [FP-MCR03-IPC_B]  (hidden comment: ERJ-3EKF49R9V)
R22  Resistance: 49.9Ω  Power Rating: 0.1W  [FP-MCR03-IPC_B]  (hidden comment: ERJ-3EKF49R9V)
R23  Resistance: 49.9Ω  Power Rating: 0.1W  [FP-MCR03-IPC_B]  (hidden comment: ERJ-3EKF49R9V)
R24  Resistance: 49.9Ω  Power Rating: 0.1W  [FP-MCR03-IPC_B]  (hidden comment: ERJ-3EKF49R9V)
R25  Resistance: 49.9Ω  Power Rating: 0.1W  [FP-MCR03-IPC_B]  (hidden comment: ERJ-3EKF49R9V)
U4  TLV3502AID  Manufacturer Print: TEXAS INSTRUMENTS  [FP-D0008A-IPC_B]  (parts A,B of 2)
U5  TLV3502AID  Manufacturer Print: TEXAS INSTRUMENTS  [FP-D0008A-IPC_B]  (parts A,B of 2)
U6  TLV3502AID  Manufacturer Print: TEXAS INSTRUMENTS  [FP-D0008A-IPC_B]  (parts A,B of 2)
X3  2.54-2*3  [SAMTEC_TSW-103-05-G-D]

### Blocks framed on the sheet
OVERCURRENT REFERENCES AND TEST PORTS: C17 C18 R16-R18 X3
V OVERCURRENT DETECTION: C19-C21 R14 R15 R19 U4
U OVERCURRENT DETECTION: C22-C24 R20-R22 U5
W OVERCURRENT DETECTION: C25-C27 R23-R25 U6

### Ports
IU_MEAS (in, see TopSheet[2A], Connector_Inverter[1B]), IV_MEAS (in, see TopSheet[2A], Connector_Inverter[1B]), IW_MEAS (in, see TopSheet[2A], Connector_Inverter[1B]), U_HI_OC (out, see TopSheet[3A], OvercurrentDetectionLogic[1A]), U_LO_OC (out, see TopSheet[3A], OvercurrentDetectionLogic[1A]), V_HI_OC (out, see TopSheet[3A], OvercurrentDetectionLogic[1B]), V_LO_OC (out, see TopSheet[3A], OvercurrentDetectionLogic[1B]), W_HI_OC (out, see TopSheet[3A], OvercurrentDetectionLogic[1B]), W_LO_OC (out, see TopSheet[3B], OvercurrentDetectionLogic[1B])

### Nets
GND: C17.2 C18.2 C19.2 C20.2 C21.2 C22.2 C23.2 C24.2 C25.2 C26.2 C27.2 C28.2 C29.2 C30.2 C31.2 C32.2 C33.2 C34.2 C35.2 R18.2 U4.5(V-) U5.5(V-) U6.5(V-)
VCC3.3V: C28.1 C29.1 C30.1 C31.1 C32.1 C33.1 C34.1 C35.1 R16.1 U4.8(V+) U5.8(V+) U6.8(V+)
HI_OC_REF: C17.1 R16.2 R17.1 U4.1(+IN_A) U5.1(+IN_A) U6.1(+IN_A)
IU_MEAS: R21.1 X3.02
IV_MEAS: R15.1 X3.04
IW_MEAS: R24.1 X3.06
LO_OC_REF: C18.1 R17.2 R18.1 U4.4(-IN_B) U5.4(-IN_B) U6.4(-IN_B)
OpAinSig1: X3.01 ; port IU_MEAS
OpAinSig2: X3.03 ; port IV_MEAS
OpAinSig3: X3.05 ; port IW_MEAS
U_HI_OC: C22.1 R20.2 ; port U_HI_OC
U_LO_OC: C24.1 R22.2 ; port U_LO_OC
V_HI_OC: C19.1 R14.2 ; port V_HI_OC
V_LO_OC: C21.1 R19.2 ; port V_LO_OC
W_HI_OC: C25.1 R23.2 ; port W_HI_OC
W_LO_OC: C27.1 R25.2 ; port W_LO_OC
NetC20_1: C20.1 R15.2 U4.2(-IN_A) U4.3(+IN_B)
NetC23_1: C23.1 R21.2 U5.2(-IN_A) U5.3(+IN_B)
NetC26_1: C26.1 R24.2 U6.2(-IN_A) U6.3(+IN_B)
NetR14_1: R14.1 U4.7(OUT_A)
NetR19_1: R19.1 U4.6(OUT_B)
NetR20_1: R20.1 U5.7(OUT_A)
NetR22_1: R22.1 U5.6(OUT_B)
NetR23_1: R23.1 U6.7(OUT_A)
NetR25_1: R25.1 U6.6(OUT_B)

### Notes on the sheet
- Trips at +/- 49.5 A
- (near X3) - Place Jumpers for normal operation
  - Remove jumpers and feed in test signals
  for testing OC events
- Title
- Revision:
- Design Engineer:
- Date:
- Project:
- Sheet
- of
- (in symbol CMP-04896-000023-1, part A) +; -
- (in symbol CMP-04896-000023-1, part B) +; -

### Library data of the parts
C17 C18 = CMP-2006-03057-2: CAP CER 0.1UF 25V X7R 0603; Manufacturer: KEMET; Value: 0.10μF; Material: Ceramic; Tolerance: 0.1; Temperature Coefficient: 30ppm/°C; Automotive Grade: Grade 1; Lead Free: Yes; Device Class L3: Ceramic Capacitors; Manufacturer Part Number: C0603C104K3RACTU; Digikey Description: CAP CER 0.1UF 25V X7R 0603; Mouser Description: Multilayer Ceramic Capacitors MLCC - SMD/SMT 25volts 0.1uF X7R 10%; Package: 0603; Temperature Range Low: -55°C; Automotive: Yes; Device Class L2: Capacitors; Octopart: https://octopart.com/c0603c104k3ractu-kemet-127541; ComponentLink2Description: Datasheet; ComponentLink2URL: https://api.kemet.com/component-edge/download/datasheet/C0603C100J5GACAUTO.pdf; Temperature Range High: +125°C; RoHS: TRUE; Device Class L1: Passive Components; Category: Cap; Temperature: -55°C to +125°C; Height: 0.87mm; Temperature Characteristic: X7R
C19 C21 C22 C24 C25 C27 = CL10C560JB8NNNC: CAP CER 56PF 50V C0G/NP0 0603; Manufacturer: SAMSUNG; Material: Ceramic; Tolerance: 5%; Dielectric: C0G; Temperature Coefficient: 30ppm/°C; Supplier 1: Arrow Electronics; Manufacturer Part Number: CL10C560JB8NNNC; RoHS: Yes; Category: Ceramic Capacitors; Stock 1: 60182; Pricing 1: 1=0.05960, 10=0.01370, 25=0.01360, 100=0.01080, 250=0.01070, 500=0.00740, 1000=0.00590, 3000=0.00560, 6000=0.00530, 15000=0.00500, 30000=0.00470 (USD); Mount: Surface Mount; Case Code (Metric): 1608; Case Code (Imperial): 0603; Min Operating Temperature: -55°C; Max Operating Temperature: 125°C; Packaging: Tape and Reel; Package Quantity: 1; Voltage: 50V; Voltage Rating (DC): 50V; Series: CL; Construction: Flat; Termination: SMD/SMT; Length: 1.6mm; Width: 0.031inch; Height: 0.8mm; Thickness: 0.035inch; Depth: 0.8mm; Radiation Hardening: No; Lead Free: Lead Free; RoHS Compliant: Yes; ComponentLink1URL: https://datasheet.ciiva.com/25803/cl10c560jb8nnnc-25803592.pdf?src-supplier=Digi-Key; ComponentLink1Description: https://datasheet.ciiva.com/25803/cl10c560jb8nnnc-25803592.pdf?src-supplier=Digi-Key; ComponentLink2URL: https://datasheet.ciiva.com/26838/getdatasheetpartid-640760-26838546.pdf?src-supplier=Verical; ComponentLink2Description: https://datasheet.ciiva.com/26838/getdatasheetpartid-640760-26838546.pdf?src-supplier=Verical; ComponentLink3URL: https://datasheet.ciiva.com/29198/456837-da-01-en-vs-kondensator-0603-29198873.pdf?src-supplier=Conrad; ComponentLink3Description: https://datasheet.ciiva.com/29198/456837-da-01-en-vs-kondensator-0603-29198873.pdf?src-supplier=Conrad; ComponentLink4URL: https://datasheet.ciiva.com/48428/mlcc-catalogdownload2013-eng-48428598.pdf?src-supplier=Distrelec; ComponentLink4Description: https://datasheet.ciiva.com/48428/mlcc-catalogdownload2013-eng-48428598.pdf?src-supplier=Distrelec; ComponentLink5URL: https://datasheet.ciiva.com/16449/cl05b104kq5nnnc-16449527.pdf?src-supplier=Future+Electronics; ComponentLink5Description: https://datasheet.ciiva.com/16449/cl05b104kq5nnnc-16449527.pdf?src-supplier=Future+Electronics; Supplier Part Number 1: CL10C560JB8NNNC; Package: 0603; Value: 56pF
C20 C23 C26 = C0603C472K3RAC7867: CAP CER 4700PF 25V 10% X7R 0603; Manufacturer: KEMET; Manufacturer Part Number: C0603C472K3RACTU; Dielectric Material: Ceramic; Value: 4.7nF; Supplier 1: Newark; RoHS: Yes; Category: Ceramic Capacitors; Stock 1: 8000; Pricing 1: 1=0.04800, 4000=0.04800 (USD); Mount: Surface Mount; Package: 0603; Case Code (Metric): 1608; Case Code (Imperial): 0603; Min Operating Temperature: -55°C; Max Operating Temperature: 125°C; Tolerance: 10%; Dielectric: X7R; Packaging: Tape and Reel; Package Quantity: 1; Voltage Rating (DC): 25V; Termination: SMD/SMT; Dissipation Factor: 10%; Series: C; Construction: Flat; Length: 1.6mm; Width: 0.031inch; Height: 0.8mm; Thickness: 0.034inch; Lead Pitch: 0.7mm; Depth: 0.8mm; Radiation Hardening: No; Reach SVHC Compliant: Yes; RoHS Compliant: Yes; ComponentLink1URL: https://datasheet.ciiva.com/5414/kem-c1002-x7r-smd-357932-5414293.pdf?src-supplier=Mouser; ComponentLink1Description: https://datasheet.ciiva.com/5414/kem-c1002-x7r-smd-357932-5414293.pdf?src-supplier=Mouser; Supplier Part Number 1: 67AH9250
C28-C31 = C0603C104K5RAC3121: as C10 on sheet CurrentConditioning; Manufacturer Part Number: C0603C104K5RAC3121; PartID: 99; Created On: 11/08/2022 14:33:29; ComponentLink1Description: Datasheet; ComponentLink1URL: https://www.mouser.de/datasheet/2/212/KEM_C1023_X7R_AUTO_SMD-1093309.pdf; Component Type: Capacitor 0603; Device Package: 0603; Last Updated: 19/08/2022 08:26:58; Mounting Type: SMD; Operating Temperature: -55 - 125°C; Series: X7R; Supplier 1: Mouser; Supplier Part Number 1: 80-C603C104K5RAC3121; Supplier 2: LCSC; Supplier Part Number 2: C14663; Type: Capacitor; Value: 100 nF; Live Cycle Status: 1; LCSC Part Number: C14663; Stock number: not stored
C32-C35 = C0603C105K3RAC7411: as C16 on sheet Transmitters; Manufacturer Part Number: C0603C105K3RAC7411; PartID: 4; Created On: 20/12/2020 13:54:13; ComponentLink1Description: Datasheet; ComponentLink1URL: https://www.mouser.de/datasheet/2/212/KEM_C1002_X7R_SMD-1102033.pdf; Component Type: Capacitor 0603; Device Package: 0603; Last Updated: 20/12/2020 16:43:05; Mounting Type: SMD; Operating Temperature: -55 - 125°C; Series: SMD Comm X7R; Supplier 1: Mouser; Supplier Part Number 1: 80-C0603C105K3RLR; Type: Capacitor; Value: 1 µF; Live Cycle Status: 1; Stock number: Labor SMD Container; LCSC Part Number: C29936
R14 R15 R19-R25 = ERJ-3EKF49R9V: RES SMD 49.9 OHM 1% 1/10W 0603; Manufacturer: PANASONIC; Temperature Coefficient: 100ppm/°C; Voltage Rating: 75V; Max Power Dissipation: 100mW; Voltage Rating (DC): 50V; Working Voltage: 6V; Value: 49.9Ω; Supplier 1: Newark; Manufacturer Part Number: ERJ-3EKF49R9V; RoHS: Yes; Category: Chip SMD Resistors; Stock 1: 670000; Pricing 1: 1=0.00600, 5000=0.00600 (USD); Mount: Surface Mount; Package: 0603; Contact Plating: Tin; Case Code (Imperial): 0603; Case Code (Metric): 1608; Min Operating Temperature: -55°C; Max Operating Temperature: 155°C; Tolerance: 1%; Resistor Type: Thick Film; Packaging: Tape and Reel; Package Quantity: 5000; Number of Terminations: 2; Termination: SMD/SMT; Features: Automotive AEC-Q200; Series: ERJ; Resistance Tolerance: 1%; Construction: Rectangular; Technology: THICK FILM; Length: 1.6mm; Width: 0.8mm; Height: 0.022inch; Depth: 0.8mm; Radiation Hardening: No; Reach SVHC Compliant: Yes; Military Standard: Not; Lead Free: Lead Free; RoHS Compliant: Yes; ComponentLink1URL: https://datasheet.ciiva.com/46388/1678782-46388908.pdf?src-supplier=Element14; ComponentLink1Description: https://datasheet.ciiva.com/46388/1678782-46388908.pdf?src-supplier=Element14; ComponentLink2URL: https://datasheet.ciiva.com/28694/1678782-28694219.pdf?src-supplier=Element14; ComponentLink2Description: https://datasheet.ciiva.com/28694/1678782-28694219.pdf?src-supplier=Element14; ComponentLink3URL: https://datasheet.ciiva.com/16772/70260748-16772570.pdf?src-supplier=Allied+Electronics; ComponentLink3Description: https://datasheet.ciiva.com/16772/70260748-16772570.pdf?src-supplier=Allied+Electronics; ComponentLink4URL: https://datasheet.ciiva.com/16766/70260748-16766262.pdf?src-supplier=Allied+Electronics; ComponentLink4Description: https://datasheet.ciiva.com/16766/70260748-16766262.pdf?src-supplier=Allied+Electronics; ComponentLink5URL: https://datasheet.ciiva.com/9117/aoa0000ce2-9117128.pdf?src-supplier=Avnet; ComponentLink5Description: https://datasheet.ciiva.com/9117/aoa0000ce2-9117128.pdf?src-supplier=Avnet; ComponentLink6URL: https://datasheet.ciiva.com/48531/aoa0000ce2-48531019.pdf?src-supplier=Avnet; ComponentLink6Description: https://datasheet.ciiva.com/48531/aoa0000ce2-48531019.pdf?src-supplier=Avnet; ComponentLink7URL: https://datasheet.ciiva.com/30095/aoa0000ce2-30095355.pdf?src-supplier=Onlinecomponents.com; ComponentLink7Description: https://datasheet.ciiva.com/30095/aoa0000ce2-30095355.pdf?src-supplier=Onlinecomponents.com; Supplier Part Number 1: 12AC1058
R16 R18 = RT0603BRD07110RL: -55℃~+155℃ 100mW 110Ω 75V Thin Film Resistor ±0.1% ±25ppm/℃ 0603 Chip Resistor; Manufacturer: YAGEO; Created from: MHoerner; Manufacturer Part Number: RT0603BRD07110RL; PartID: 395; Created On: 11.06.2026 09:50:14; ComponentLink1Description: Datasheet; ComponentLink1URL: https://www.lcsc.com/datasheet/C705717.pdf?spm=wm.sxq.inf.ggs___wm.fly.bg.0.xh&lcsc_vid=FVULV11UQQVZVQFfRlANUAdQRVAPUAdeQlVcVlZXQFcxVlNeRlBYUVNeRVBaUDsOAxUeFF5JWBYZEEoKFBINSQcJGk4%3D; Component Type: SMD resistor; Device Package: 0603; Last Updated: 11.06.2026 09:50:14; Mounting Type: SMD; Supplier 1: LCSC; Supplier Part Number 1: C705717; Supplier 2: LCSC; Supplier Part Number 2: C705717; Type: Resistor; Tolerance: 0.1%; Value: 110R; Live Cycle Status: 1; LCSC Part Number: C705717
R17 = PTFR0603B887RN9: -55℃~+155℃ 100mW 887Ω 100V Thin Film Resistor ±0.1% ±10ppm/℃ 0603 Chip Resistor; Manufacturer: RESI; Created from: MHoerner; Manufacturer Part Number: PTFR0603B887RN9; PartID: 396; Created On: 11.06.2026 09:50:14; ComponentLink1Description: Datasheet; ComponentLink1URL: https://www.lcsc.com/datasheet/C47115921.pdf?spm=wm.sxq.inf.ggs___wm.fly.bg.0.xh&lcsc_vid=EQNYVVAFQVNdUwFRFgUPXlRURAANUFNWFgdZBgZURFgxVlNeRlBYUFFTRFRfVDsOAxUeFF5JWBYZEEoKFBINSQcJGk4eFQsCAgIaSgADAwAHC0slQFFbUFVRWQkaCgg%3D; Component Type: SMD resistor; Device Package: 0603; Last Updated: 11.06.2026 09:50:14; Mounting Type: SMD; Supplier 1: LCSC; Supplier Part Number 1: C47115921; Supplier 2: LCSC; Supplier Part Number 2: C47115921; Type: Resistor; Tolerance: 0.1%; Value: 887R; Live Cycle Status: 1; LCSC Part Number: C47115921
U4-U6 = CMP-04896-000023-1: IC COMPARATOR R-R HI-SPD 8-SOIC; Nominal Supply Current: 3.2mA; Standoff Height: 0.11mm; Max Supply Voltage: 5.5V; Min Supply Voltage: 2.2V; Input Bias Current: 0.000002uA; Number Of Channels: 2; Max Junction Temp: +150°C; Input Offset Voltage: 1mV; Automotive: No; Device Class L1: Integrated Circuits (ICs); Lead Free: Yes; Octopart: https://octopart.com/tlv3502aid-texas+instruments-428400; Temperature Range Low: -40°C; ComponentLink2Description: Datasheet; ComponentLink2URL: http://www.ti.com/lit/ds/symlink/tlv3502.pdf; Ambient Temperature Range Low: -40°C; Height: 1.75mm; Manufacturer: TEXAS INSTRUMENTS; Digikey Description: IC COMPARATOR R-R HI-SPD 8-SOIC; Ambient Temperature Range High: +125°C; RoHS: TRUE; Device Class L3: Comparators; Device Class L2: Linear ICs; Temperature: -40°C to +125°C; Manufacturer Part Number: TLV3502AID; Temperature Range High: +125°C; Package: 8-SOIC; Category: IC; Mouser Description: TLV3502AID Texas Instruments, Dual Comparator, Push-Pull O/P, 3 V, 5 V 8-Pin SOIC; Value: N/A
X3 = 2.54-2*3: as X2 on sheet Connector_Inverter; Availability: Unavailable; Value: *; Price: None; MP: TSW-103-05-G-D; Package: None; Manufacturer Part Number: 2.54-2*3; PartID: 14; Created On: 05.07.2023 16:24:09; ComponentLink1Description: Datasheet; ComponentLink1URL: https://datasheet.lcsc.com/lcsc/2207291800_ZHOURI-2-54-1-3_C5116482.pdf; Component Type: Pin Header; Device Package: THT; Last Updated: 11.02.2025 12:55:43; Mounting Type: THT; Operating Temperature: -55 -125 °C; Series: 2.54-1*3; Supplier 1: LCSC; Supplier Part Number 1: ZHOURI 2.54-1*3; Type: Pin Header; Live Cycle Status: 1; LCSC Part Number: C5116479; Stock number: not stored; Number of rows: 2

## Sheet Receivers.SchDoc
size A4; Organization: UltraZohm; DocumentNumber: 5; SheetNumber: 5; SheetTotal: 11; Website: www.ultrazohm.com
Used 7 times, as channels R1, R2, R3, R4, R5, R6, R7. Parts and nets are listed once, with the designators drawn on the sheet.
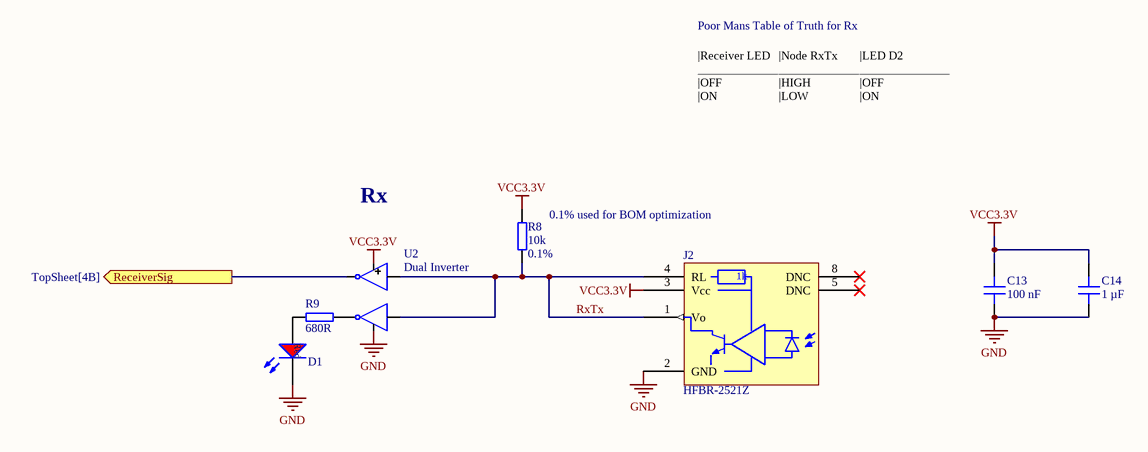
[diagram p5: Receivers.SchDoc]

### Parts
C13  100 nF  [C_0603]
C14  1 µF  [C_0603]
D1  150060RS75000  [WL-SMCW_0603]  (value not drawn)
J2  HFBR-2521Z  [HFBRx5XX]
R8  10k  Tolerance: 0.1%  [RES 0603_1608]
R9  680R  [R_0603_N]
U2  Dual Inverter  [SN74LVC2GU04DCKR]

### Ports
ReceiverSig (out, see TopSheet[4B])

### Nets
GND: C13.2 C14.2 D1.1(K) J2.2(GND) U2.2(GND)
VCC3.3V: C13.1 C14.1 J2.3(Vcc) R8.1 U2.5(VCC)
ReceiverSig: U2.6(OUT2) ; port ReceiverSig
RxTx: J2.1(Vo) J2.4(RL) R8.2 U2.1(IN1) U2.3(IN2)
NetD1_2: D1.2(A) R9.2
NetR9_1: R9.1 U2.4(OUT2)

Not connected (* = marked no-connect by the designer): J2 5(DNC)* 8(DNC)*

### Channels
R1: designators end in A; ports ReceiverSig=ReceiverSig1
R2: designators end in B; ports ReceiverSig=ReceiverSig2
R3: designators end in C; ports ReceiverSig=ReceiverSig3
R4: designators end in D; ports ReceiverSig=ReceiverSig4
R5: designators end in E; ports ReceiverSig=ReceiverSig5
R6: designators end in F; ports ReceiverSig=ReceiverSig6
R7: designators end in G; ports ReceiverSig=Gate_Enable

### Notes on the sheet
- Poor Mans Table of Truth for Rx
- |Receiver LED
  ________________
  |OFF
  |ON
- |Node RxTx
  _________________
  |HIGH
  |LOW
- |LED D2
  _______________
  |OFF
  |ON
- GATE
  _______
  LOW
  HIGH
- Rx
- (near R8) 0.1% used for BOM optimization
- Title
- Revision:
- Design Engineer:
- Date:
- Project:
- Sheet
- of
- (in symbol HFBR-2521Z) 1k

### Library data of the parts
C13 = C0603C104K5RAC3121: as C10 on sheet CurrentConditioning; Manufacturer Part Number: C0603C104K5RAC3121; PartID: 99; Created On: 11/08/2022 14:33:29; ComponentLink1Description: Datasheet; ComponentLink1URL: https://www.mouser.de/datasheet/2/212/KEM_C1023_X7R_AUTO_SMD-1093309.pdf; Component Type: Capacitor 0603; Device Package: 0603; Last Updated: 19/08/2022 08:26:58; Mounting Type: SMD; Operating Temperature: -55 - 125°C; Series: X7R; Supplier 1: Mouser; Supplier Part Number 1: 80-C603C104K5RAC3121; Supplier 2: LCSC; Supplier Part Number 2: C14663; Type: Capacitor; Value: 100 nF; Live Cycle Status: 1; LCSC Part Number: C14663; Stock number: not stored
C14 = C0603C105K3RAC7411: as C16 on sheet Transmitters; Manufacturer Part Number: C0603C105K3RAC7411; PartID: 4; Created On: 20/12/2020 13:54:13; ComponentLink1Description: Datasheet; ComponentLink1URL: https://www.mouser.de/datasheet/2/212/KEM_C1002_X7R_SMD-1102033.pdf; Component Type: Capacitor 0603; Device Package: 0603; Last Updated: 20/12/2020 16:43:05; Mounting Type: SMD; Operating Temperature: -55 - 125°C; Series: SMD Comm X7R; Supplier 1: Mouser; Supplier Part Number 1: 80-C0603C105K3RLR; Type: Capacitor; Value: 1 µF; Live Cycle Status: 1; Stock number: Labor SMD Container; LCSC Part Number: C29936
D1 = LED_Red_0603: WL-SMCW SMD Mono-color Chip LED Waterclear, size 0603, Red, 2 V, 140°; Forward Voltage: 2 V; Luminous Intensity: 250 mcd; Peak Wavelength: 630 nm; Dominant Wavelength: 625 nm; MF: Wuerth Elektronik; Published Date: Sep. 2017; ComponentLink1Description: Manufacturer; ComponentLink1URL: http://www.we-online.de; ComponentLink2Description: Datasheet; ComponentLink2URL: http://katalog.we-online.com/led/datasheet/150060RS75000.pdf; MPN: 150060RS75000; Size: 0603; Viewing Angle: 140°; Emitting Color: Red; Value: 150060RS75000; Package: 0603; Created: 2018_09_06_AGeiger; Supplier 1: Farnell; Supplier Part Number 1: 2322071; Supplier 2: Mouser; Supplier Part Number 2: 710-150060RS75000; Supplier 3: Digi-Key; Supplier Part Number 3: 732-4978-1-ND; LCSC Part Number: C2286
J2 = HFBR-2521Z: Fibre Optic Receivers, LINK HORIZ 5MBd RC VR RoHS; Suppier Part Number 2: 516-2062-ND; Manufacturer: Broadcom; MF: Boadcom/Avago; Wavelength: 660 nm; Iout max: 25 mA; Supply Voltage: 5V; Created from: VStarost; Created: 2019_04_09_Kreppel; MPN: HFBR-2521Z; Data Rate: 5 MBd; Supplier 1: Mouser; Supplier 2: Digi-Key; Supplier Part Number 1: 630-HFBR-2521Z; Manufacturer Part Number: HFBR-2521Z; PartID: 1; Created On: 27.12.2022 09:44:37; ComponentLink1Description: Datasheet; ComponentLink1URL: https://datasheet.ciiva.com/19453/1584669-19453911.pdf?src-supplier=Jameco; Component Type: LWL Receiver; Device Package: THT; Last Updated: 27.12.2022 09:44:37; Mounting Type: THT; Series: HFBR; Type: LWL Receiver; Live Cycle Status: 1; Stock number: not stored
R8 = ERA-3ARB103V: as R2 on sheet CurrentConditioning; Manufacturer Part Number: ERA-3ARB103V; PartID: 217; Created On: 14/12/2020 16:17:14; ComponentLink1Description: Datasheet; ComponentLink1URL: https://www.mouser.de/datasheet/2/315/AOA0000C307-1149632.pdf; Component Type: SMD resistor; Device Package: 0603; Last Updated: 25/07/2022 10:07:28; Mounting Type: SMD; Supplier 1: Mouser; Supplier Part Number 1: 667-ERA-3ARB103V; Type: Resistor; Value: 10k; Live Cycle Status: 1; Stock number: not stored; LCSC Part Number: C860067
R9 = R_0603: as R12 on sheet Transmitters; Package: 0603; Value: 680R; Created: 2018_09_06_AGeiger; Supplier 1: Mouser; Supplier Part Number 1: 652-CR0603-FX3901ELF; LCSC Part Number: C23228
U2 = SN74LVC2GU04DCKR: as U3 on sheet Transmitters; JLCSMT Rotation: 180; LCSC Part Number: C116660